# Altium project PCB_Project.PrjPcb
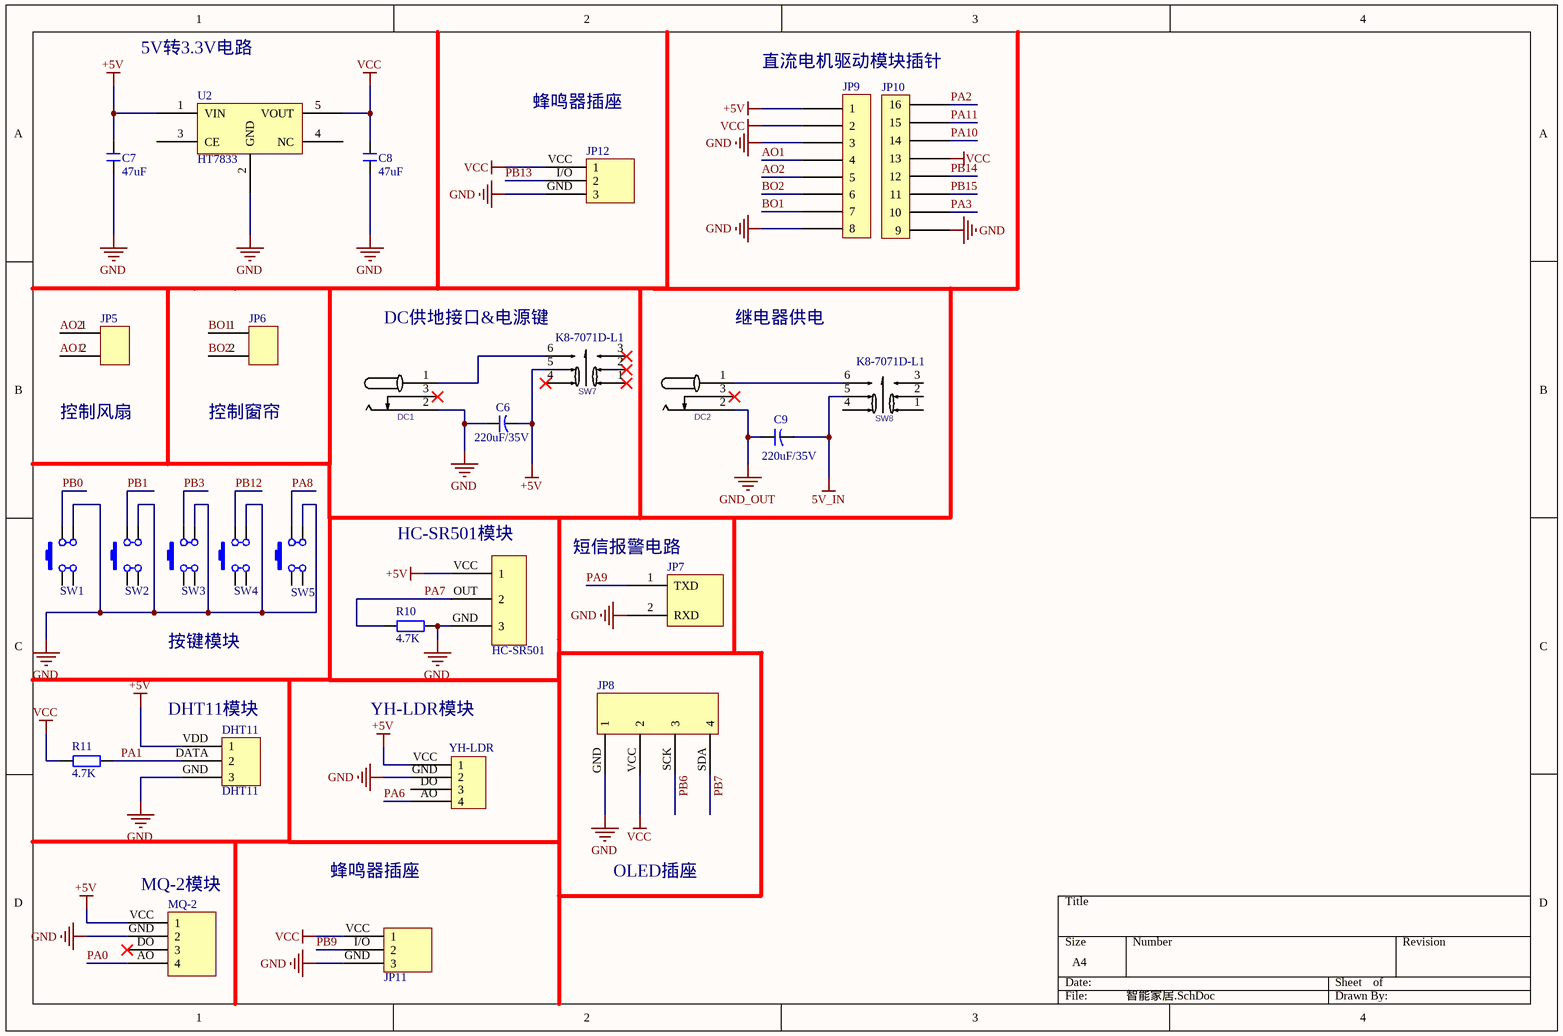
[diagram p0: 智能家居.SchDoc]
2 sheets, 55 parts. Net scope: global (net labels, ports and power ports of the same name join across sheets).
Board file: 智能家居.PcbDoc
Sheets:
  智能家居.SchDoc
  智能家居图纸2.SchDoc

## Sheet 智能家居.SchDoc
size A4; SheetNumber: 1; SheetTotal: 2; SPICEModelCacheQIYRVTXZ: <root> / <DocumentId>QIYRVTXZ</DocumentId> / </root>

### Parts
C6  CAP2  [CAP]  (value not drawn)
C7  47uF  [47uF]
C8  47uF  [47uF]
C9  220uF/35V  [CAP]
DC1  DC005  [DC005]  (value not drawn)
DC2  DC005  [DC005]  (value not drawn)
DHT11  DHT11  [HAR1X3-3]
HC-SR1  HC-SR501  [HDR1X3-2]
JP5  JP1  [HDR1X2]  (value not drawn)
JP6  JP1  [HDR1X2]  (value not drawn)
JP7  JP2  [HDR1X2]  (value not drawn)
JP8  JP7  [HAR1X4-2]  (value not drawn)
JP9  JP5  [HDR1X8]  (value not drawn)
JP10  JP6  [HDR1X8-2]  (value not drawn)
JP11  JP11  [HDR1X3-3]  (value not drawn)
JP12  JP12  [HDR1X3-3]  (value not drawn)
MQ-2  MQ-2  [HAR1X4-4]  (value not drawn)
R10  4.7K  [R 0805_L]
R11  4.7K  [R 0805_L]
SW1  KEY  [KEY]  (value not drawn)
SW2  KEY  [KEY]  (value not drawn)
SW3  KEY  [KEY]  (value not drawn)
SW4  KEY  [KEY]  (value not drawn)
SW5  KEY  [KEY]  (value not drawn)
SW7  K8-7071D-L1  [K8]  (value not drawn)
SW8  K8-7071D-L1  [K8]
U2  HT7833  [HT7833]
YH-LDR1  YH-LDR  [HAR1X4-4]

### Nets
5V_IN: C9.1 SW8.5
+5V: C6.1 C7.2 DHT11.VDD(1) HC-SR1.VCC(1) JP9.1 MQ-2.VCC(1) SW7.5 U2.1(VIN) YH-LDR1.VCC(1)
GND: C6.2 C7.1 C8.1 DC1.2 DHT11.GND(3) HC-SR1.GND(3) JP7.2(RXD) JP8.GND(1) JP9.3 JP9.8 JP10.9 JP11.GND(3) JP12.GND(3) MQ-2.GND(2) R10.2 SW1.4 SW2.4 SW3.4 SW4.4 SW5.4 U2.2(GND) YH-LDR1.GND(2)
GND_OUT: C9.2 DC2.2
VCC: C8.2 JP8.VCC(2) JP9.2 JP10.13 JP11.VCC(1) JP12.VCC(1) R11.2 U2.5(VOUT)
AO1: JP5.2 JP9.4
AO2: JP5.1 JP9.5
BO1: JP6.1 JP9.7
BO2: JP6.2 JP9.6
PA0: MQ-2.AO(4)
PA1: DHT11.DATA(2) R11.1
PA2: JP10.16
PA3: JP10.10
PA6: YH-LDR1.AO(4)
PA7: HC-SR1.OUT(2) R10.1
PA8: SW5.2
PA9: JP7.1(TXD)
PA10: JP10.14
PA11: JP10.15
PB0: SW1.2
PB1: SW2.2
PB3: SW3.2
PB6: JP8.SCK(3)
PB7: JP8.SDA(4)
PB9: JP11.I/O(2)
PB12: SW4.2
PB13: JP12.I/O(2)
PB14: JP10.12
PB15: JP10.11
NetDC1_1: DC1.1 SW7.6
NetDC2_1: DC2.1 SW8.6

Not connected (* = marked no-connect by the designer): DC1 3*; DC2 3*; MQ-2 DO(3)*; SW1 1 3; SW2 1 3; SW3 1 3; SW4 1 3; SW5 1 3; SW7 1* 2* 3* 4*; SW8 1 2 3 4; U2 3(CE) 4(NC); YH-LDR1 DO(3)

### Notes on the sheet
- 5V转3.3V电路
- 蜂鸣器插座
- (near JP9) 直流电机驱动模块插针
- DC供地接口&电源键
- (near SW7) K8-7071D-L1
- 继电器供电
- (near JP5) 控制风扇
- (near JP6) 控制窗帘
- (near C6) 220uF/35V
- (near HC-SR1) HC-SR501模块
- (near JP7) 短信报警电路
- 按键模块
- (near DHT11) DHT11模块
- (near YH-LDR1) YH-LDR模块
- (near MQ-2) MQ-2模块
- OLED插座

### Library data of the parts
C7 C8 = C: 贴片电容; BOM名称: 无极性贴片电容; 淘宝ID: 封装库来自淘宝 ID：黄晶宝石; 联系售后，技术支持: https://shop463601444.taobao.com; 唯一出售店铺网址: https://shop463601444.taobao.com
C9 = CAP2
DC1 DC2 = DC005: Manufacturer: SHOU HAN(首韩); Symbol: DC005_C431533; Add into BOM: yes; Connector Type: DC电源插座; Inside Contact Diameter: 2mm; Outside Contact Diameter: 6.3mm; Current Rating (Max): 500mA; Voltage Rating (Max): 30V; Device: DC005; Supplier: LCSC; Supplier Part: C431533; Manufacturer Part: DC005; JLCPCB Part Class: Extended Part; LCSC Part Name: DC电源插座 内径:2mm 外径:6.3mm; Supplier Footprint: 插件; Datasheet: https://atta.szlcsc.com/upload/public/pdf/source/20190925/C431533_4751811035784AC1D38EBC85F7905E99.pdf; Convert to PCB: yes; Mounting Style: 弯插; Operating Temperature Range: -40℃~+55℃
DHT11 = DHT11: 温湿度传感器
HC-SR1 = HC-SR501: 人体红外热释电传感器
JP5 JP6 = JP1: 插针
JP7 = JP2: USB转串口
JP8 = JP7: OLED引脚插针
JP9 = JP5: 直流电机驱动模块插针第一列
JP10 = JP6: 直流电机驱动模块第二列
JP11 = JP11: 蜂鸣器插针
MQ-2 = MQ-2: 烟雾传感器
R10 R11 = R: 贴片电阻; 版权归属: 来自淘宝 ID：黄晶宝石; 封装库来自淘宝卖家 ID：黄晶宝石: 其他店铺购入均为盗版，不享受售后技术支持服务，请立即申请退款; BOM名称: 贴片电阻; 联系售后: https://shop463601444.taobao.com
SW1-SW5 = KEY: 普通按键
SW7 SW8 = K8-7071D-L1: Manufacturer: 韩国韩荣; Add into BOM: yes; Contact Current: 100mA; Voltage Rating (DC): 30V; Insulation Resistance: 100mΩ; Self Lock / No Lock: 自锁; Actuator Style: 矩形柱塞; Actuator/Cap Color: 蓝色; With Lamp: 无; Pin Style: PC引脚; Operating Force: 230gf@±50gf; Mechanical Life: 100000; Symbol: K8-7071D-L1; Device: K8-7071D-L1; LCSC Part Name: K8-7071D-L1; Supplier Part: C111759; Manufacturer Part: K8-7071D-L1; Supplier Footprint: 插件; JLCPCB Part Class: Extended Part; Datasheet: https://atta.szlcsc.com/upload/public/pdf/source/20210810/1E23F383FB1C24682B487C492BB0592B.pdf; Supplier: LCSC; Convert to PCB: yes; Voltage Rating (AC): -; Mounting Style: 直插; IP Rating: -; Operating Temperature: -25℃~+80℃
U2 = HT7833: 5V转3.3V电路
YH-LDR1 = YH-LDR: 光敏传感器

## Sheet 智能家居图纸2.SchDoc
size A4; SheetNumber: 2; SheetTotal: 2; SPICEModelCacheMWUIDHTT: <root> / <DocumentId>MWUIDHTT</DocumentId> / <CacheFrame Number="0"> / <Model Name="led0" Kind="MDL"> / <Text>*Typ INFRARED GaAs LED: Vf=1.2V Vr=5V If=40mA trr=3uS / *LED Pinout: 1=A, 2=K / .MODEL LED0 D (IS=93.5P RS=84M N=2.63 BV=5 IBV=10U / + CJO=2.97P VJ=.75 M=.333 TT=4.32U)</Text> / </Model> / <Model Name="led1" Kind="MDL"> / <Text>*Typ RED GaAs LED: Vf=1.7V Vr=4V If=40mA trr=3uS / *LED Pinout: 1=A, 2=K / .MODEL LED1 D (IS=93.2P RS=42M N=3.73 BV=4 IBV=10U / + CJO=2.97P VJ=.75 M=.333 TT=4.32U)</Text> / </Model> / <Model Name="led2" Kind="MDL"> / <Text>*Typ RED,GREEN,YELLOW,AMBER GaAs LED: Vf=2.1V Vr=4V If=40mA trr=3uS / *LED Pinout: 1=A, 2=K / .MODEL LED2 D (IS=93.1P RS=42M N=4.61 BV=4 IBV=10U / + CJO=2.97P VJ=.75 M=.333 TT=4.32U)</Text> / </Model> / <Model Name="led3" Kind="MDL"> / <Text>*Typ BLUE SiC LED: Vf=3.4V Vr=5V If=40mA trr=3uS / *LED Pinout: 1=A, 2=K / .MODEL LED3 D (IS=93.1P RS=42M N=7.47 BV=5 IBV=30U / + CJO=2.97P VJ=.75 M=.333 TT=4.32U)</Text> / </Model> / </CacheFrame> / </root>
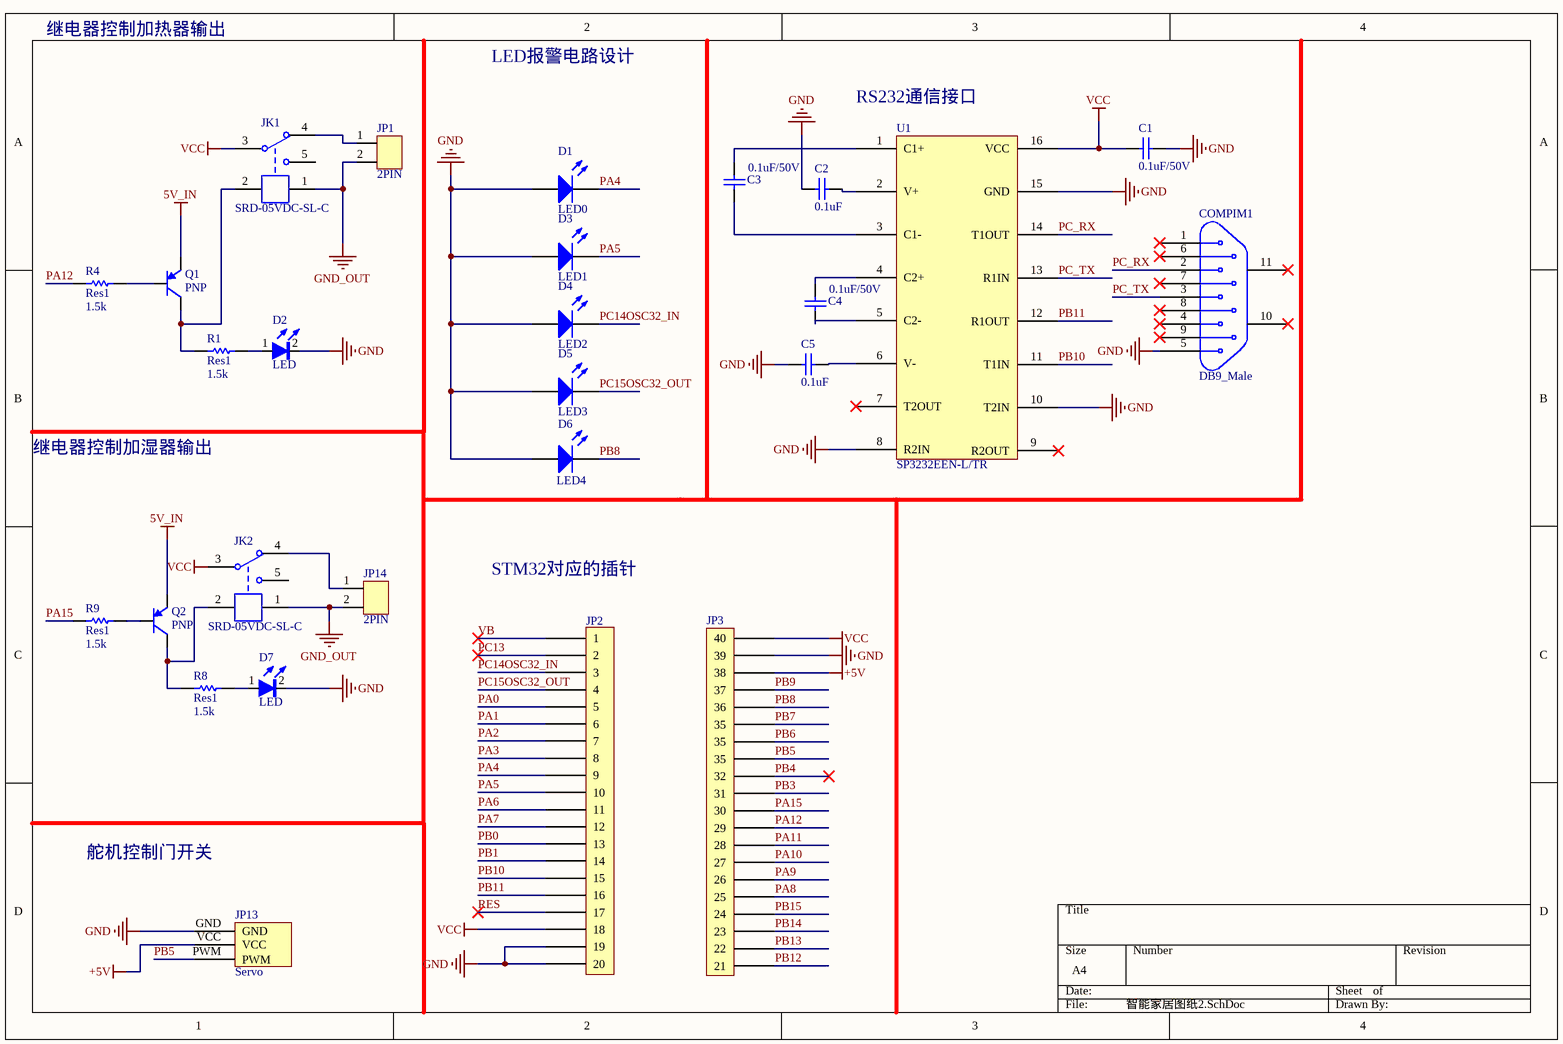
[diagram p1: 智能家居图纸2.SchDoc]

### Parts
C1  value 0.1uF/50V  [C0603]  (hidden comment: Cap)
C2  value 0.1uF  [C0603]  (hidden comment: Cap)
C3  value 0.1uF/50V  [C0603]  (hidden comment: Cap)
C4  value 0.1uF/50V  [C0603]  (hidden comment: Cap)
C5  value 0.1uF  [C0603]  (hidden comment: Cap)
COMPIM1  DB9_Male  [DB9Male]
D1  LED0  [LED-Green]
D2  LED  [LED-Green]
D3  LED1  [LED-Red]
D4  LED2  [LED-White]
D5  LED3  [LED-yellow]
D6  LED4  [LED-yellow]
D7  LED  [LED-Red]
JK1  SRD-05VDC-SL-C  [SRD-C_B]
JK2  SRD-05VDC-SL-C  [SRD-C_B]
JP1  2PIN  [2PIN]
JP2  JP3  [HDR1X20]  (value not drawn)
JP3  JP4  [HDR1X20-2]  (value not drawn)
JP13  Servo  [HDR1X3-5]
JP14  2PIN  [2PIN]
Q1  PNP  [PNP]
Q2  PNP  [PNP]
R1  Res1  value 1.5k  [R200]
R4  Res1  value 1.5k  [R200]
R8  Res1  value 1.5k  [R200]
R9  Res1  value 1.5k  [R200]
U1  SP3232EEN-L/TR  [SOP127P600X175-16N]

### Nets
5V_IN: Q1.3(E) Q2.3(E)
+5V: JP3.38 JP13.VCC
GND: C1.1 C2.1 C5.1 COMPIM1.5 D1.1(A) D2.2 D3.1(A) D4.1(A) D5.1(A) D6.1(A) D7.2 JP2.19 JP2.20 JP3.39 JP13.GND U1.8(R2IN) U1.10(T2IN) U1.15(GND)
GND_OUT: JK1.1 JK2.1 JP1.2 JP14.2
VCC: C1.2 JK1.3 JK2.3 JP2.18 JP3.40 U1.16(VCC)
PA0: JP2.5
PA1: JP2.6
PA2: JP2.7
PA3: JP2.8
PA4: D1.2(K) JP2.9
PA5: D3.2(K) JP2.10
PA6: JP2.11
PA7: JP2.12
PA8: JP3.25
PA9: JP3.26
PA10: JP3.27
PA11: JP3.28
PA12: JP3.29 R4.2
PA15: JP3.30 R9.2
PB0: JP2.13
PB1: JP2.14
PB3: JP3.31
PB4: JP3.32
PB5: JP3.33(35) JP13.PWM
PB6: JP3.34(35)
PB7: JP3.35
PB8: D6.2(K) JP3.36
PB9: JP3.37
PB10: JP2.15 U1.11(T1IN)
PB11: JP2.16 U1.12(R1OUT)
PB12: JP3.21
PB13: JP3.22
PB14: JP3.23
PB15: JP3.24
PC13: JP2.2
PC14OSC32_IN: D4.2(K) JP2.3
PC15OSC32_OUT: D5.2(K) JP2.4
PC_RX: COMPIM1.2 U1.14(T1OUT)
PC_TX: COMPIM1.3 U1.13(R1IN)
RES: JP2.17
VB: JP2.1
NetC2_2: C2.2 U1.2(V+)
NetC3_1: C3.1 U1.3(C1-)
NetC3_2: C3.2 U1.1(C1+)
NetC4_1: C4.1 U1.5(C2-)
NetC4_2: C4.2 U1.4(C2+)
NetC5_2: C5.2 U1.6(V-)
NetD2_1: D2.1 R1.2
NetD7_1: D7.1 R8.2
NetJK1_2: JK1.2 Q1.2(C) R1.1
NetJK1_4: JK1.4 JP1.1
NetJK2_2: JK2.2 Q2.2(C) R8.1
NetJK2_4: JK2.4 JP14.1
NetQ1_1: Q1.1(B) R4.1
NetQ2_1: Q2.1(B) R9.1

Not connected (* = marked no-connect by the designer): COMPIM1 1* 4* 6* 7* 8* 9* 10* 11*; JK1 5; JK2 5; U1 7(T2OUT)* 9(R2OUT)*

### Notes on the sheet
- 继电器控制加热器输出
- LED报警电路设计
- (near U1) RS232通信接口
- 继电器控制加湿器输出
- STM32对应的插针
- 舵机控制门开关

### Library data of the parts
C1-C5 = Cap: Capacitor; Published: 8-Jun-2000; LatestRevisionDate: 17-Jul-2002; LatestRevisionNote: Re-released for DXP Platform.; PackageReference: RAD-0.3; Publisher: Altium Limited; PackageDescription: Radial Cap, Thru-Hole; 2 Leads; 0.3 in Pin Spacing
COMPIM1 = DB9_Male: 9针串口线  RS232
D1 = LED0: Typical INFRARED GaAs LED; Published: 8-Jun-2000; LatestRevisionDate: 08-Jul-2005; LatestRevisionNote: Mech Layer 1 removed.; PackageReference: LED-0; Publisher: Altium Limited; PackageDescription: LED; 2 Leads
D2 D6 D7 = LED: 发光二极管
  D6: 技术支持，联系售后: https://shop463601444.taobao.com
D3 = LED1: Typical RED GaAs LED; Published: 8-Jun-2000; LatestRevisionDate: 08-Jul-2005; LatestRevisionNote: Mech Layer 1 removed.; PackageReference: LED-1; Publisher: Altium Limited; PackageDescription: LED; 2 Leads
D4 = LED2: Typical RED, GREEN, YELLOW, AMBER GaAs LED; Published: 8-Jun-2000; LatestRevisionDate: 17-Jul-2002; LatestRevisionNote: Re-released for DXP Platform.; PackageVersion: Feb-2002; PackageReference: 3.2X1.6X1.1; Publisher: Altium Limited; PackageDescription: SM LED; 2 Flat Leads
D5 = LED3: Typical BLUE SiC LED; Published: 8-Jun-2000; LatestRevisionDate: 17-Dec-2003; LatestRevisionNote: PCB Footprint replaced.; DatasheetVersion: 16-Apr-2002; PackageVersion: 16-Apr-2002; PackageReference: 3.5X2.8X1.9; Publisher: Altium Limited; PackageDescription: SM LED; 2 C-Bend Leads; Body 3.5 x 2.8 x 1.9 mm, inc leads (LxWxH typ)
JK1 JK2 = SRD-05VDC-SL-C: 5V一组转换; BOM名称: 5V继电器; 版权归属: 封装库来自淘宝卖家 ID：黄晶宝石; 学习资源: https://shop463601444.taobao.com
JP1 JP14 = JP: 插针
JP2 = JP3: STM32插针第一列
JP3 = JP4: STM32插针第二列
JP13 = Servo: 舵机
Q1 Q2 = 45H11: 互补功率-PNP型; 版权归属: 封装库来自淘宝 ID：黄晶宝石; 属性: 80V 8A 50W; BOM名称: 互补功率-PNP型; 技术支持，联系售后: https://shop463601444.taobao.com
R1 R4 R8 R9 = Res1: Resistor; Published: 8-Jun-2000; LatestRevisionDate: 17-Jul-2002; LatestRevisionNote: Re-released for DXP Platform.; PackageReference: AXIAL-0.3; Publisher: Altium Limited; PackageDescription: Axial Device, Thru-Hole; 2 Leads; 0.3 in Pin Spacing
U1 = SP3232EEN-L/TR: RS-232接口集成电路

## Nets that join several sheets
5V_IN: 智能家居 (C9.1 SW8.5), 智能家居图纸2 (Q1.3 Q2.3)
+5V: 智能家居 (9 pins), 智能家居图纸2 (JP3.38 JP13.VCC)
GND: 智能家居 (22 pins), 智能家居图纸2 (18 pins)
GND_OUT: 智能家居 (C9.2 DC2.2), 智能家居图纸2 (JK1.1 JK2.1 JP1.2 JP14.2)
VCC: 智能家居 (8 pins), 智能家居图纸2 (6 pins)
PA0: 智能家居 (MQ-2.AO), 智能家居图纸2 (JP2.5)
PA1: 智能家居 (DHT11.DATA R11.1), 智能家居图纸2 (JP2.6)
PA2: 智能家居 (JP10.16), 智能家居图纸2 (JP2.7)
PA3: 智能家居 (JP10.10), 智能家居图纸2 (JP2.8)
PA6: 智能家居 (YH-LDR1.AO), 智能家居图纸2 (JP2.11)
PA7: 智能家居 (HC-SR1.OUT R10.1), 智能家居图纸2 (JP2.12)
PA8: 智能家居 (SW5.2), 智能家居图纸2 (JP3.25)
PA9: 智能家居 (JP7.1), 智能家居图纸2 (JP3.26)
PA10: 智能家居 (JP10.14), 智能家居图纸2 (JP3.27)
PA11: 智能家居 (JP10.15), 智能家居图纸2 (JP3.28)
PB0: 智能家居 (SW1.2), 智能家居图纸2 (JP2.13)
PB1: 智能家居 (SW2.2), 智能家居图纸2 (JP2.14)
PB3: 智能家居 (SW3.2), 智能家居图纸2 (JP3.31)
PB6: 智能家居 (JP8.SCK), 智能家居图纸2 (JP3.34)
PB7: 智能家居 (JP8.SDA), 智能家居图纸2 (JP3.35)
PB9: 智能家居 (JP11.I/O), 智能家居图纸2 (JP3.37)
PB12: 智能家居 (SW4.2), 智能家居图纸2 (JP3.21)
PB13: 智能家居 (JP12.I/O), 智能家居图纸2 (JP3.22)
PB14: 智能家居 (JP10.12), 智能家居图纸2 (JP3.23)
PB15: 智能家居 (JP10.11), 智能家居图纸2 (JP3.24)